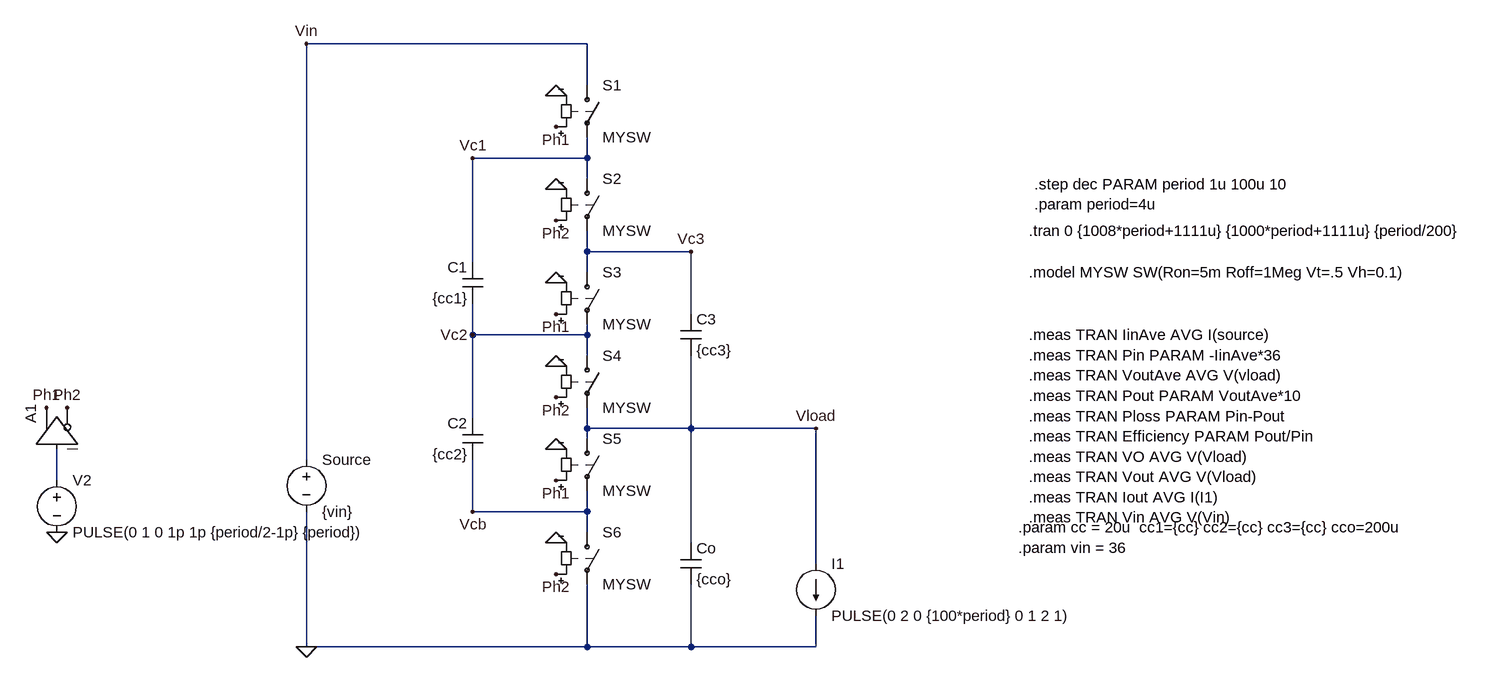
[diagram p0: schematic Ladder_3to1_soft.asc]
Ladder_3to1_soft.asc, the LTspice schematic file:
Version 4
SHEET 1 1688 680
WIRE 0 -496 -432 -496
WIRE 0 -432 0 -496
WIRE 0 -320 0 -352
WIRE 0 -320 -176 -320
WIRE 0 -288 0 -320
WIRE 0 -176 0 -208
WIRE 160 -176 0 -176
WIRE -176 -160 -176 -320
WIRE 0 -144 0 -176
WIRE 160 -80 160 -176
WIRE -176 -48 -176 -96
WIRE 0 -48 0 -64
WIRE 0 -48 -176 -48
WIRE 0 -16 0 -48
WIRE -176 80 -176 -48
WIRE 0 96 0 64
WIRE 160 96 160 -16
WIRE 160 96 0 96
WIRE 352 96 160 96
WIRE 0 112 0 96
WIRE -432 144 -432 -496
WIRE -816 176 -816 128
WIRE -176 224 -176 144
WIRE 0 224 0 192
WIRE 0 224 -176 224
WIRE 0 256 0 224
WIRE 160 272 160 96
WIRE 352 304 352 96
WIRE -432 432 -432 224
WIRE 0 432 0 336
WIRE 0 432 -432 432
WIRE 160 432 160 336
WIRE 160 432 0 432
WIRE 352 432 352 384
WIRE 352 432 160 432
FLAG -816 256 0
FLAG -832 64 Ph1
FLAG -800 64 Ph2
FLAG -432 432 0
FLAG -48 -416 0
FLAG -48 -272 0
FLAG -432 -496 Vin
FLAG 352 96 Vload
FLAG -48 -128 0
FLAG -48 0 0
FLAG -48 128 0
FLAG -48 272 0
FLAG -48 -368 Ph1
FLAG -48 176 Ph1
FLAG -48 -80 Ph1
FLAG -48 -224 Ph2
FLAG -48 48 Ph2
FLAG -48 320 Ph2
FLAG -176 -320 Vc1
FLAG -176 -48 Vc2
FLAG -176 224 Vcb
FLAG 160 -176 Vc3
SYMBOL voltage -816 160 R0
WINDOW 123 0 0 Left 2
WINDOW 39 0 0 Left 2
SYMATTR InstName V2
SYMATTR Value PULSE(0 1 0 1p 1p {period/2-1p} {period})
SYMBOL Digital\\buf -880 128 R270
SYMATTR InstName A1
SYMBOL voltage -432 128 R0
WINDOW 123 0 0 Left 2
WINDOW 39 0 0 Left 2
SYMATTR InstName Source
SYMATTR Value {vin}
SYMBOL cap -160 -96 R180
WINDOW 0 24 56 Left 2
WINDOW 3 24 8 Left 2
SYMATTR InstName C1
SYMATTR Value {cc1}
SYMATTR SpiceLine ic = {vin/3} Rser = 2m
SYMBOL sw 0 -448 R0
SYMATTR InstName S1
SYMATTR Value MYSW
SYMBOL sw 0 240 R0
SYMATTR InstName S6
SYMATTR Value MYSW
SYMBOL sw 0 -304 R0
SYMATTR InstName S2
SYMATTR Value MYSW
SYMBOL cap 144 272 R0
SYMATTR InstName Co
SYMATTR Value {cco}
SYMATTR SpiceLine ic = {vin/3} Rser = 2m
SYMBOL sw 0 -160 R0
SYMATTR InstName S3
SYMATTR Value MYSW
SYMBOL sw 0 -32 R0
SYMATTR InstName S4
SYMATTR Value MYSW
SYMBOL sw 0 96 R0
SYMATTR InstName S5
SYMATTR Value MYSW
SYMBOL cap -160 144 R180
WINDOW 0 24 56 Left 2
WINDOW 3 24 8 Left 2
SYMATTR InstName C2
SYMATTR Value {cc2}
SYMATTR SpiceLine ic = {vin/3} Rser = 2m
SYMBOL cap 144 -80 R0
SYMATTR InstName C3
SYMATTR Value {cc3}
SYMATTR SpiceLine ic = {vin/3} Rser = 2m
SYMBOL current 352 304 R0
WINDOW 123 0 0 Left 2
WINDOW 39 0 0 Left 2
SYMATTR InstName I1
SYMATTR Value PULSE(0 2 0 {100*period} 0 1 2 1)
TEXT 680 -144 Left 2 !.model MYSW SW(Ron=5m Roff=1Meg Vt=.5 Vh=0.1)
TEXT 680 -48 Left 2 !.meas TRAN IinAve AVG I(source)\n.meas TRAN Pin PARAM -IinAve*36\n.meas TRAN VoutAve AVG V(vload)\n.meas TRAN Pout PARAM VoutAve*10\n.meas TRAN Ploss PARAM Pin-Pout\n.meas TRAN Efficiency PARAM Pout/Pin\n.meas TRAN VO AVG V(Vload)\n.meas TRAN Vout AVG V(Vload)\n.meas TRAN Iout AVG I(I1)\n.meas TRAN Vin AVG V(Vin)
TEXT 664 248 Left 2 !.param cc = 20u  cc1={cc} cc2={cc} cc3={cc} cco=200u\n.param vin = 36
TEXT 680 -208 Left 2 !.tran 0 {1008*period+1111u} {1000*period+1111u} {period/200}
TEXT 688 -280 Left 2 !.step dec PARAM period 1u 100u 10\n.param period=4u

The netlist it stands for:
* Ladder_3to1_soft.asc
V2 N001 0 PULSE(0 1 0 1p 1p {period/2-1p} {period})
A1 N001 0 0 0 0 Ph2 Ph1 0 BUF
V§Source Vin 0 {vin}
C1 Vc2 Vc1 {cc1} ic = {vin/3} Rser = 2m
S1 Vin Vc1 Ph1 0 MYSW
S6 Vcb 0 Ph2 0 MYSW
S2 Vc1 Vc3 Ph2 0 MYSW
Co Vload 0 {cco} ic = {vin/3} Rser = 2m
S3 Vc3 Vc2 Ph1 0 MYSW
S4 Vc2 Vload Ph2 0 MYSW
S5 Vload Vcb Ph1 0 MYSW
C2 Vcb Vc2 {cc2} ic = {vin/3} Rser = 2m
C3 Vc3 Vload {cc3} ic = {vin/3} Rser = 2m
I1 Vload 0 PULSE(0 2 0 {100*period} 0 1 2 1)
.model MYSW SW(Ron=5m Roff=1Meg Vt=.5 Vh=0.1)
.meas TRAN IinAve AVG I(source)
.meas TRAN Pin PARAM -IinAve*36
.meas TRAN VoutAve AVG V(vload)
.meas TRAN Pout PARAM VoutAve*10
.meas TRAN Ploss PARAM Pin-Pout
.meas TRAN Efficiency PARAM Pout/Pin
.meas TRAN VO AVG V(Vload)
.meas TRAN Vout AVG V(Vload)
.meas TRAN Iout AVG I(I1)
.meas TRAN Vin AVG V(Vin)
.param cc = 20u  cc1={cc} cc2={cc} cc3={cc} cco=200u
.param vin = 36
.tran 0 {1008*period+1111u} {1000*period+1111u} {period/200}
.step dec PARAM period 1u 100u 10
.param period=4u
.backanno
.end